# EAGLE schematic TEG-TEC Thermal Sensing and Regulating Board (EAGLE 9.5.1)

## Sheet 1 of 2
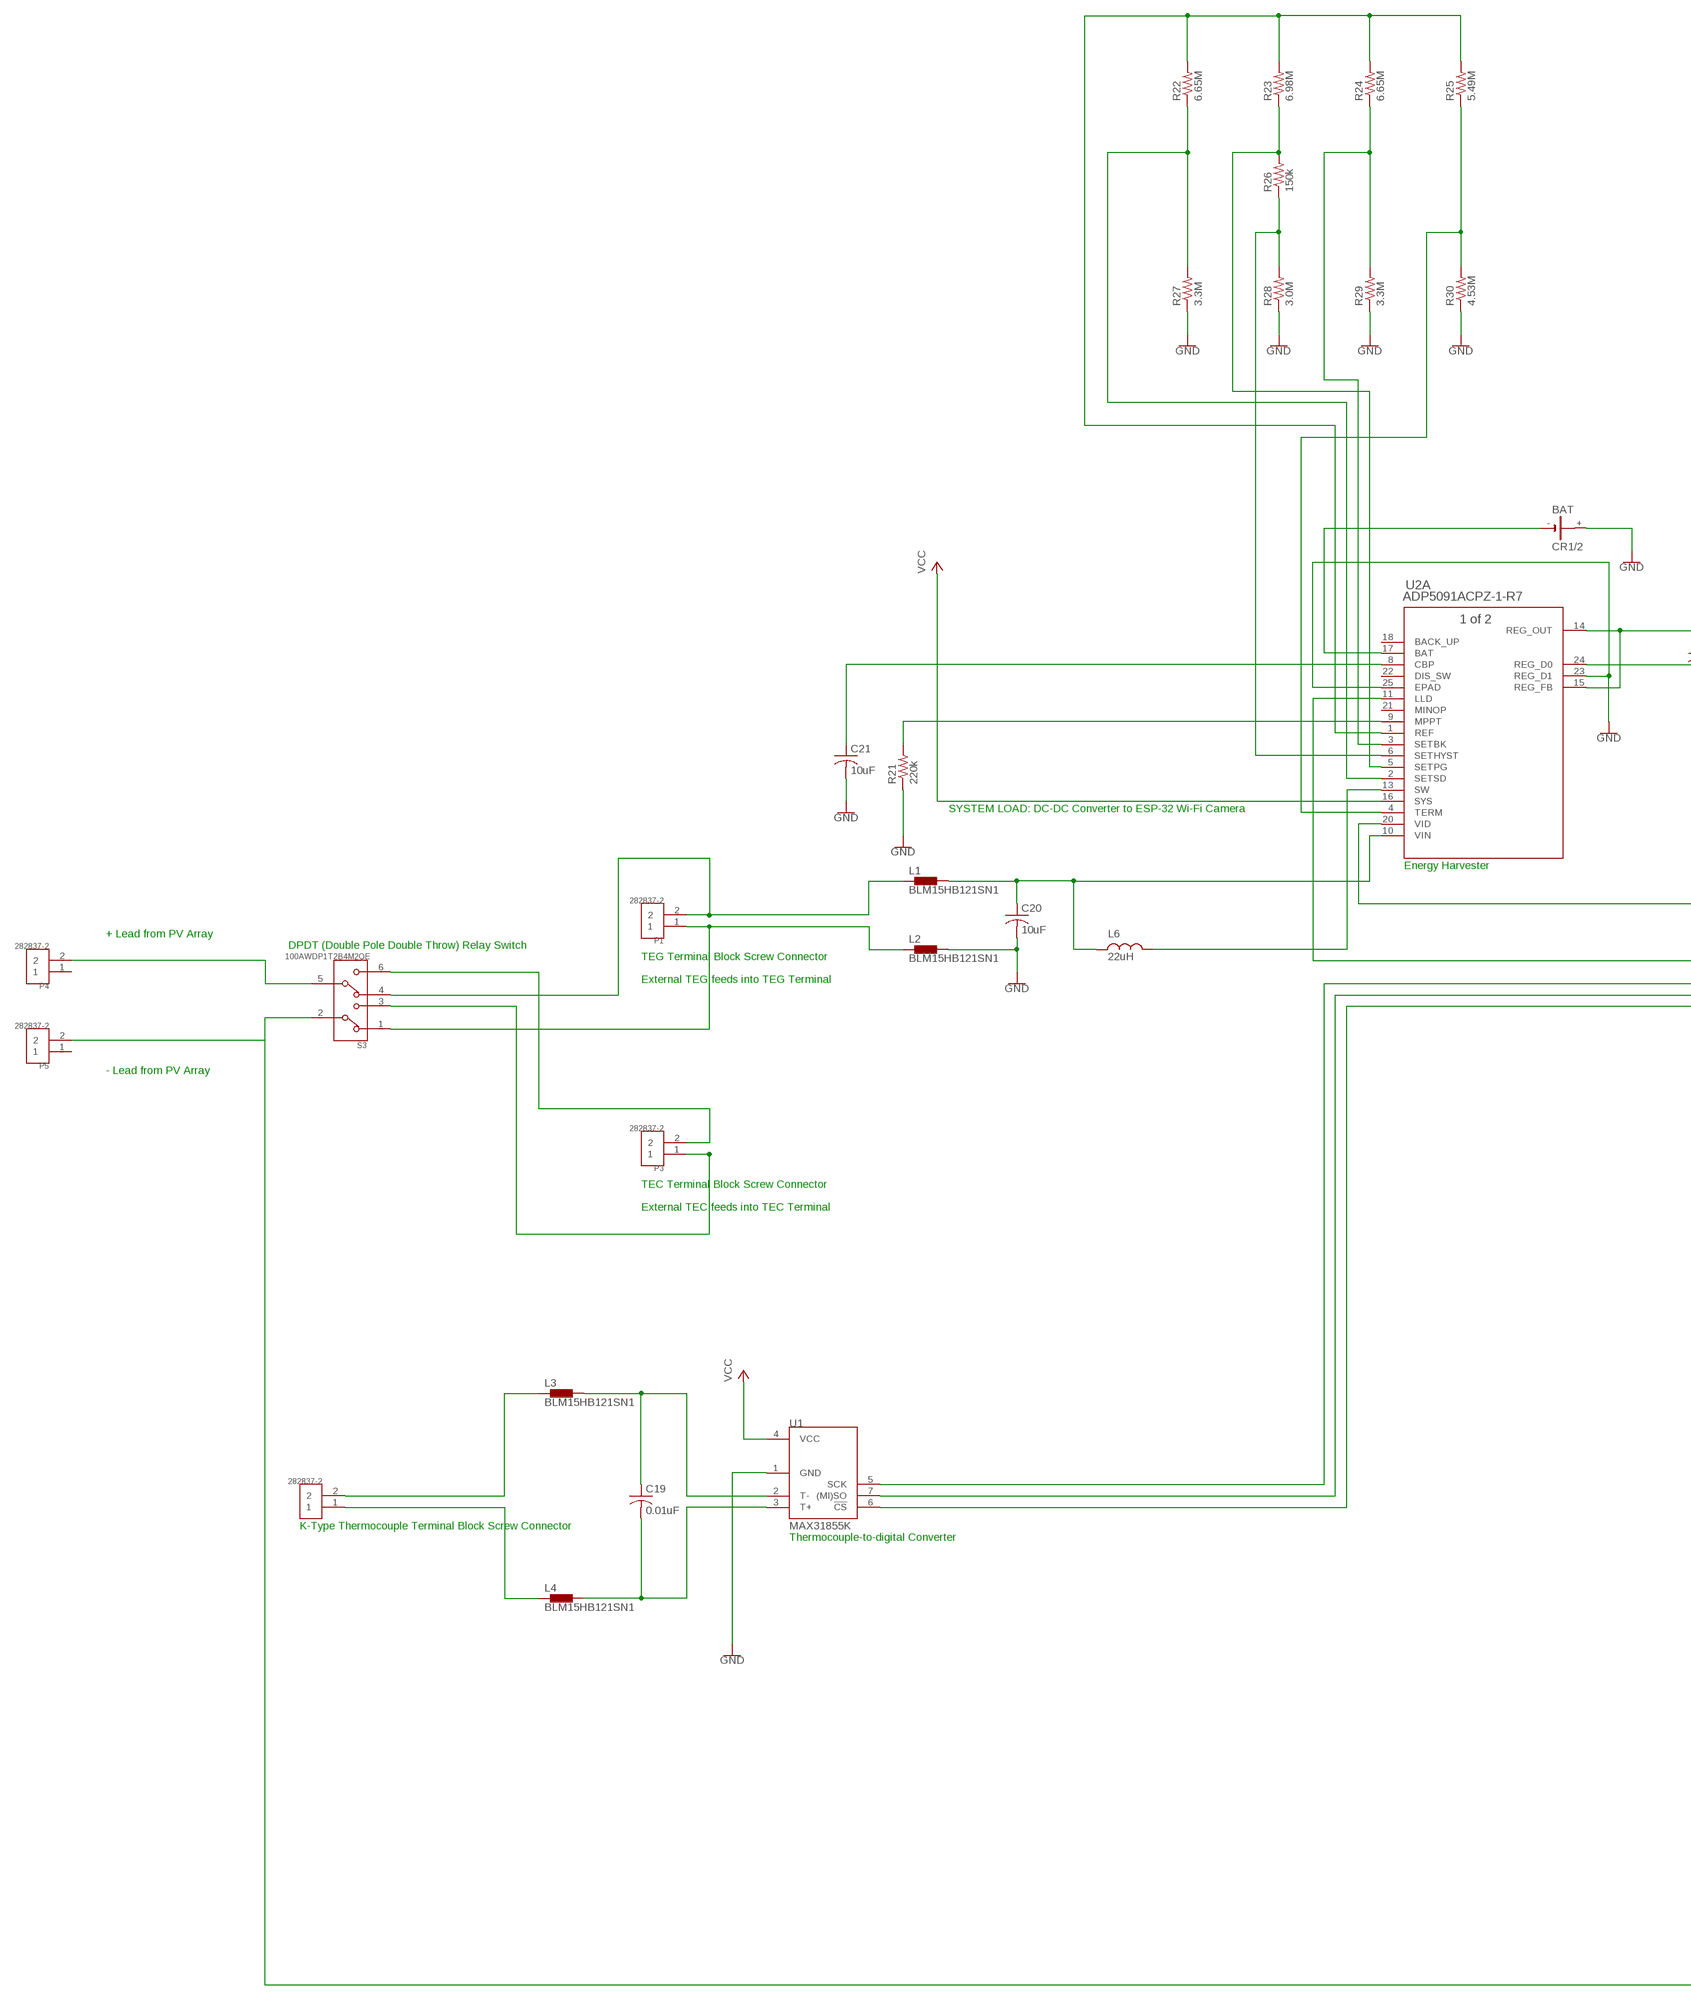
[diagram p0: schematic, sheet 1, part 1 of 2]
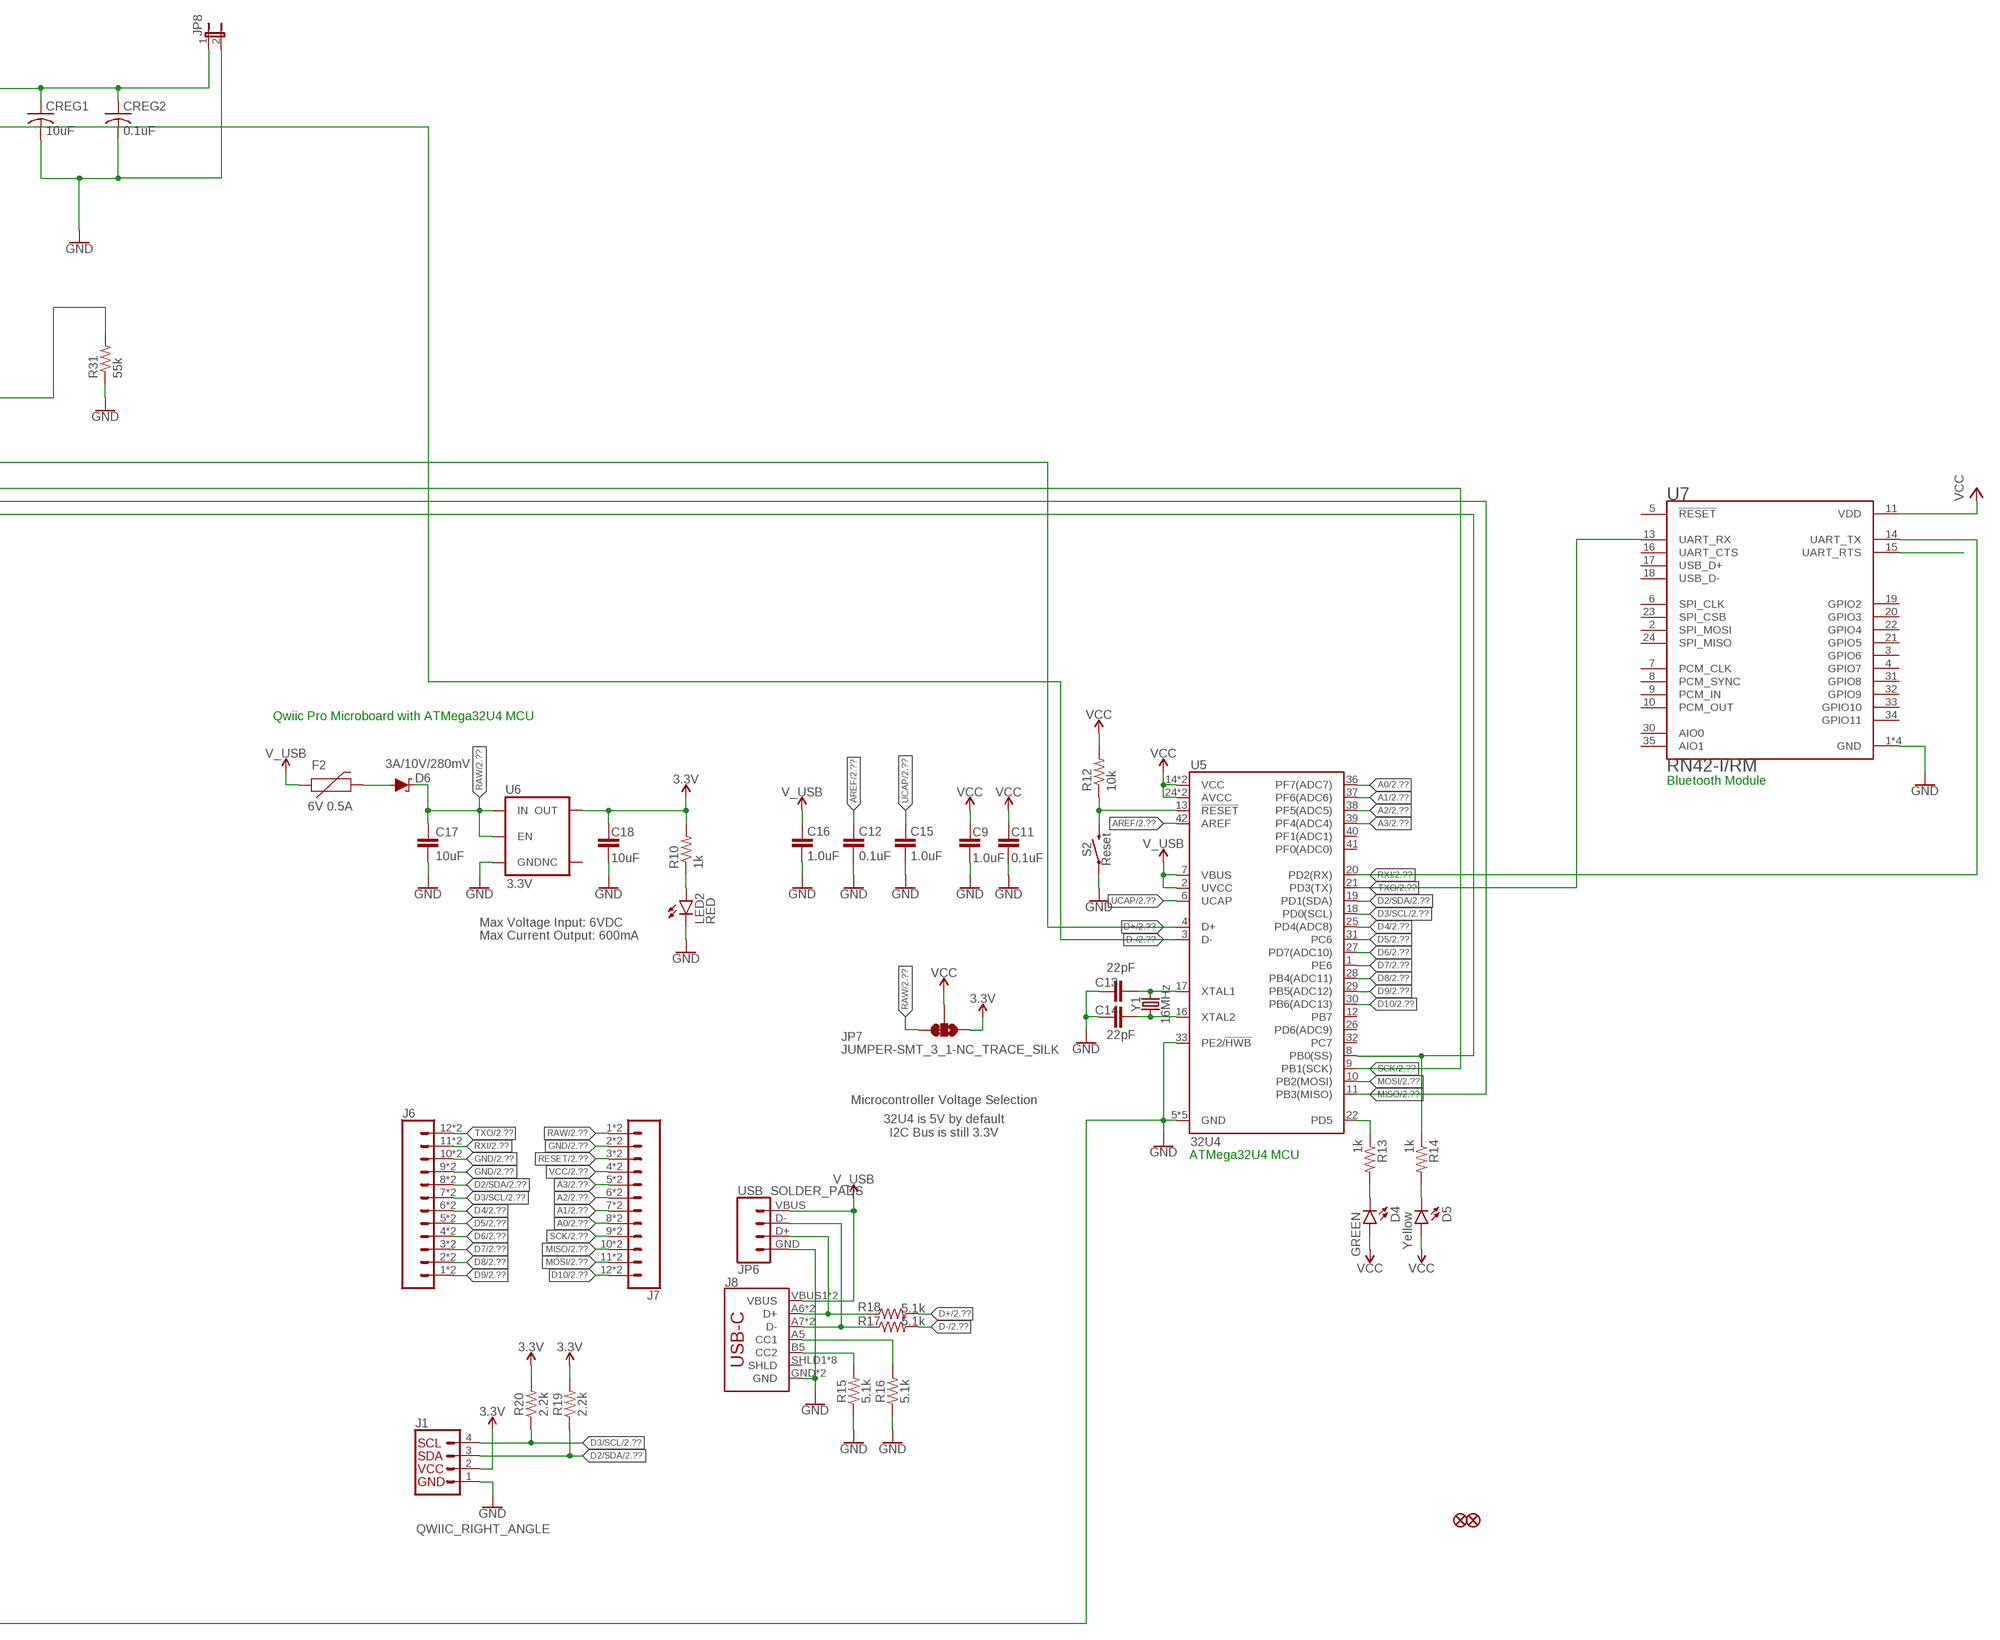
[diagram p1: schematic, sheet 1, part 2 of 2]

### Parts
BAT  CR1/2  [CR1/2]
C9  1.0uF  1.0UF-0402T-16V-10%  [0402-TIGHT]
C11  0.1uF  0.1UF-0402T-16V-10%  [0402-TIGHT]
C12  0.1uF  0.1UF-0402T-16V-10%  [0402-TIGHT]
C13  22pF  22PF-0402T-16V-10%  [0402-TIGHT]
C14  22pF  22PF-0402T-16V-10%  [0402-TIGHT]
C15  1.0uF  1.0UF-0402T-16V-10%  [0402-TIGHT]
C16  1.0uF  1.0UF-0402T-16V-10%  [0402-TIGHT]
C17  10uF  10UF-0603-6.3V-20%  [0603]
C18  10uF  10UF-0603-6.3V-20%  [0603]
C19  0.01uF  C-US025-024X044  [C025-024X044]
C20  10uF  C-US025-024X044  [C025-024X044]
C21  10uF  C-US025-024X044  [C025-024X044]
CREG1  10uF  C-US025-024X044  [C025-024X044]
CREG2  0.1uF  C-US025-024X044  [C025-024X044]
D4  GREEN  LED-GREEN0603  [LED-0603]
D5  Yellow  LED-YELLOW0603  [LED-0603]
D6  3A/10V/280mV  DIODE-SCHOTTKY-BAT60A  [SOD-323]
F2  6V 0.5A  PPTC_6V500MA  [0805]
J1  QWIIC_RIGHT_ANGLE  QWIIC_CONNECTORJS-1MM  [JST04_1MM_RA]
J6  CONN_12CASTLE  [1X12_CASTELLATED]
J7  CONN_12CASTLE  [1X12_CASTELLATED]
J8  USB_C5  [USB-C-16P-5]
JP3  FIDUCIAL1X2  [FIDUCIAL-1X2]
JP5  FIDUCIAL1X2  [FIDUCIAL-1X2]
JP6  USB_SOLDER_PADS  [USB-SOLDER-PADS]
JP7  JUMPER-SMT_3_1-NC_TRACE_SILK  [SMT-JUMPER_3_1-NC_TRACE_SILK]
JP8  JP1E  [JP1]
L1  BLM15HB121SN1  [0402]
L2  BLM15HB121SN1  [0402]
L3  BLM15HB121SN1  [0402]
L4  BLM15HB121SN1  [0402]
L6  22uH  L  (no package)
LED2  RED  LED-RED0603  [LED-0603]
P1  282837-2  [TE_282837-2]
P2  282837-2  [TE_282837-2]
P3  282837-2  [TE_282837-2]
P4  282837-2  [TE_282837-2]
P5  282837-2  [TE_282837-2]
R10  1k  1KOHM-0402T-1/16W-1%  [0402-TIGHT]
R12  10k  10KOHM-0402T-1/16W-1%  [0402-TIGHT]
R13  1k  1KOHM-0402T-1/16W-1%  [0402-TIGHT]
R14  1k  1KOHM-0402T-1/16W-1%  [0402-TIGHT]
R15  5.1k  5.1KOHM-0402T-1/16W-1%  [0402-TIGHT]
R16  5.1k  5.1KOHM-0402T-1/16W-1%  [0402-TIGHT]
R17  5.1k  5.1KOHM-0402T-1/16W-1%  [0402-TIGHT]
R18  5.1k  5.1KOHM-0402T-1/16W-1%  [0402-TIGHT]
R19  2.2k  2.2KOHM-0402T-1/16W-1%  [0402-TIGHT]
R20  2.2k  2.2KOHM-0402T-1/16W-1%  [0402-TIGHT]
R21  220k  R-US_0204/2V  [0204V]
R22  6.65M  R-US_0204/2V  [0204V]
R23  6.98M  R-US_0204/2V  [0204V]
R24  6.65M  R-US_0204/2V  [0204V]
R25  5.49M  R-US_0204/2V  [0204V]
R26  150k  R-US_0204/2V  [0204V]
R27  3.3M  R-US_0204/2V  [0204V]
R28  3.0M  R-US_0204/2V  [0204V]
R29  3.3M  R-US_0204/2V  [0204V]
R30  4.53M  R-US_0204/2V  [0204V]
R31  55k  R-US_0204/2V  [0204V]
S2  Reset  MOMENTARY-SWITCH-SPST-SMD-4.6X2.8MM  [TACTILE_SWITCH_SMD_4.6X2.8MM]
S3  100AWDP1T2B4M2QE  [SW_100AWDP1T2B4M2QE]
U1  MAX31855K  [SO08]
U2  ADP5091ACPZ-1-R7  [ADP5091ACPZ-1-R7_ADI]
U5  32U4  ATMEGA32U41:1-LESS_PASTE  [QFN-44-NOPAD_1:1-LESS_PASTE]
U6  3.3V  V_REG_AP2112K-3.3V  [SOT23-5]
U7  RN42-I/RM  [XCVR_RN42-I/RM]
Y1  16MHz  CRYSTAL-16MHZSMD-2X1.6  [CRYSTAL-SMD-2.0X1.6MM]

### Nets
3.3V: C18.2 J1.2 JP7.1 R10.2 R19.2 R20.2 U6.5(OUT) ; also sheet 2
A0: J7.8 J7.8B U5.36(PF7(ADC7)) ; also sheet 2
A1: J7.7 J7.7B U5.37(PF6(ADC6)) ; also sheet 2
A2: J7.6 J7.6B U5.38(PF5(ADC5)) ; also sheet 2
A3: J7.5 J7.5B U5.39(PF4(ADC4)) ; also sheet 2
AREF: C12.2 U5.42(AREF) ; also sheet 2
D2/SDA: J1.3 J6.8 J6.8B R19.1 U5.19(PD1(SDA)) ; also sheet 2
D3/SCL: J1.4 J6.7 J6.7B R20.1 U5.18(PD0(SCL)) ; also sheet 2
D4: J6.6 J6.6B U5.25(PD4(ADC8)) ; also sheet 2
D5: J6.5 J6.5B U5.31(PC6) ; also sheet 2
D6: J6.4 J6.4B U5.27(PD7(ADC10)) ; also sheet 2
D7: J6.3 J6.3B U5.1(PE6) ; also sheet 2
D8: J6.2 J6.2B U5.28(PB4(ADC11)) ; also sheet 2
D9: J6.1 J6.1B U5.29(PB5(ADC12)) ; also sheet 2
D10: J7.12 J7.12B U5.30(PB6(ADC13)) ; also sheet 2
D+: R18.2 U2.11(A:LLD) U5.4(D+) ; also sheet 2
D-: R17.2 U2.24(A:REG_D0) U5.3(D-) ; also sheet 2
D-_HV1: J8.A7(D-) J8.B7(D-) JP6.D- R17.1
DP_HV1: J8.A6(D+) J8.B6(D+) JP6.D+ R18.1
GND: BAT.+ C9.1 C11.1 C12.1 C13.2 C14.2 C15.1 C16.1 C17.1 C18.1 C20.2 C21.2 CREG1.2 CREG2.2 J1.1 J6.9 J6.9B J6.10 J6.10B J7.2 J7.2B J8.GND J8.GND2(GND) JP6.GND JP8.2 L2.2 LED2.C P5.2 R15.1 R16.1 R21.1 R27.1 R28.1 R29.1 R30.1 R31.1 S2.1 S2.2 S3.2 U1.1(GND) U5.5(GND) U5.15(GND) U5.23(GND) U5.33(PE2/!HWB) U5.35(GND) U5.43(GND) U6.2(GND) U7.1(GND) U7.12(GND) U7.28(GND) U7.29(GND) ; also sheet 2
MISO: J7.10 J7.10B U1.7((MI)SO) U5.11(PB3(MISO)) ; also sheet 2
MOSI: J7.11 J7.11B U5.10(PB2(MOSI)) ; also sheet 2
N$3: LED2.A R10.1
N$4: C14.1 U5.16(XTAL2) Y1.1
N$6: C13.1 U5.17(XTAL1) Y1.3
N$8: D5.C R14.2
N$11: D4.C R13.2
N$12: J8.A5(CC1) R16.2
N$13: J8.B5(CC2) R15.2
N$14: P3.2 S3.6
N$15: L1.1 P1.2 S3.4
N$16: L2.1 P1.1 S3.1
N$17: P3.1 S3.3
N$18: L3.1 P2.2
N$19: U7.15(UART_RTS)
N$20: L4.1 P2.1
N$21: C19.1 L3.2 U1.2(T-)
N$22: C19.2 L4.2 U1.3(T+)
N$23: C20.1 L1.2 L6.1 U2.10(A:VIN)
N$24: R21.2 U2.9(A:MPPT)
N$25: C21.1 U2.8(A:CBP)
N$26: L6.2 U2.13(A:SW)
N$27: R22.2 R23.2 R24.2 R25.2 U2.1(A:REF)
N$28: R22.1 R27.2 U2.2(A:SETSD)
N$29: R23.1 R26.2 U2.5(A:SETPG)
N$30: R26.1 R28.2 U2.6(A:SETHYST)
N$31: R24.1 R29.2 U2.3(A:SETBK)
N$32: R25.1 R30.2 U2.4(A:TERM)
N$33: CREG1.1 CREG2.1 JP8.1 U2.14(A:REG_OUT) U2.15(A:REG_FB)
N$34: BAT.- U2.17(A:BAT)
N$35: R31.2 U2.20(A:VID)
N$36: U2.23(A:REG_D1) U2.25(A:EPAD) ; supply symbol labelled GND
N$37: P4.2 S3.5
RAW [vcc]: C17.2 D6.C J7.1 J7.1B JP7.3 U6.1(IN) U6.3(EN) ; also sheet 2
RESET: J7.3 J7.3B R12.1 S2.3 S2.4 U5.13(!RESET) ; also sheet 2
RXI: J6.11 J6.11B U5.20(PD2(RX)) U7.14(UART_TX) ; also sheet 2
RXLED1: R14.1 U1.6(!CS) U5.8(PB0(SS))
SCK: J7.9 J7.9B U1.5(SCK) U5.9(PB1(SCK)) ; also sheet 2
TXLED1: R13.1 U5.22(PD5)
TXO: J6.12 J6.12B U5.21(PD3(TX)) U7.13(UART_RX) ; also sheet 2
UCAP: C15.2 U5.6(UCAP) ; also sheet 2
USB_RAW1: D6.A F2.2
V_USB: C16.2 F2.1 J8.VBUS1(VBUS) J8.VBUS2(VBUS) JP6.VBUS U5.2(UVCC) U5.7(VBUS) ; also sheet 2
VCC: C9.2 C11.2 D4.A D5.A J7.4 J7.4B JP7.2 R12.2 U1.4(VCC) U2.16(A:SYS) U5.14(VCC) U5.24(AVCC) U5.34(VCC) U5.44(AVCC) U7.11(VDD) ; also sheet 2
Unconnected: BAT.+@1(+) J8.SHLD1(SHLD) J8.SHLD2(SHLD) J8.SHLD3(SHLD) J8.SHLD4(SHLD) J8.SHLD5(SHLD) J8.SHLD6(SHLD) J8.SHLD7(SHLD) J8.SHLD8(SHLD) P4.1 P5.1 U2.7(B:AGND) U2.12(B:PGND) U2.18(A:BACK_UP) U2.19(B:PGOOD) U2.21(A:MINOP) U2.22(A:DIS_SW) U5.12(PB7) U5.26(PD6(ADC9)) U5.32(PC7) U5.40(PF1(ADC1)) U5.41(PF0(ADC0)) U6.4(NC) U7.2(SPI_MOSI) U7.3(GPIO6) U7.4(GPIO7) U7.5(!RESET) U7.6(SPI_CLK) U7.7(PCM_CLK) U7.8(PCM_SYNC) U7.9(PCM_IN) U7.10(PCM_OUT) U7.16(UART_CTS) U7.17(USB_D+) U7.18(USB_D-) U7.19(GPIO2) U7.20(GPIO3) U7.21(GPIO5) U7.22(GPIO4) U7.23(SPI_CSB) U7.24(SPI_MISO) U7.30(AIO0) U7.31(GPIO8) U7.32(GPIO9) U7.33(GPIO10) U7.34(GPIO11) U7.35(AIO1)

### Notes on the sheet
- SYSTEM LOAD: DC-DC Converter to ESP-32 Wi-Fi Camera
- Energy Harvester
- + Lead from PV Array
- DPDT (Double Pole Double Throw) Relay Switch
- TEG Terminal Block Screw Connector
- External TEG feeds into TEG Terminal
- - Lead from PV Array
- TEC Terminal Block Screw Connector | Qwiic Pro Microboard with ATMega32U4 MCU
- External TEC feeds into TEC Terminal
- Bluetooth Module
- Max Voltage Input: 6VDC
- Max Current Output: 600mA
- Microcontroller Voltage Selection
- K-Type Thermocouple Terminal Block Screw Connector
- Thermocouple-to-digital Converter
- 32U4 is 5V by default
  I2C Bus is still 3.3V
- ATMega32U4 MCU

## Sheet 2 of 2
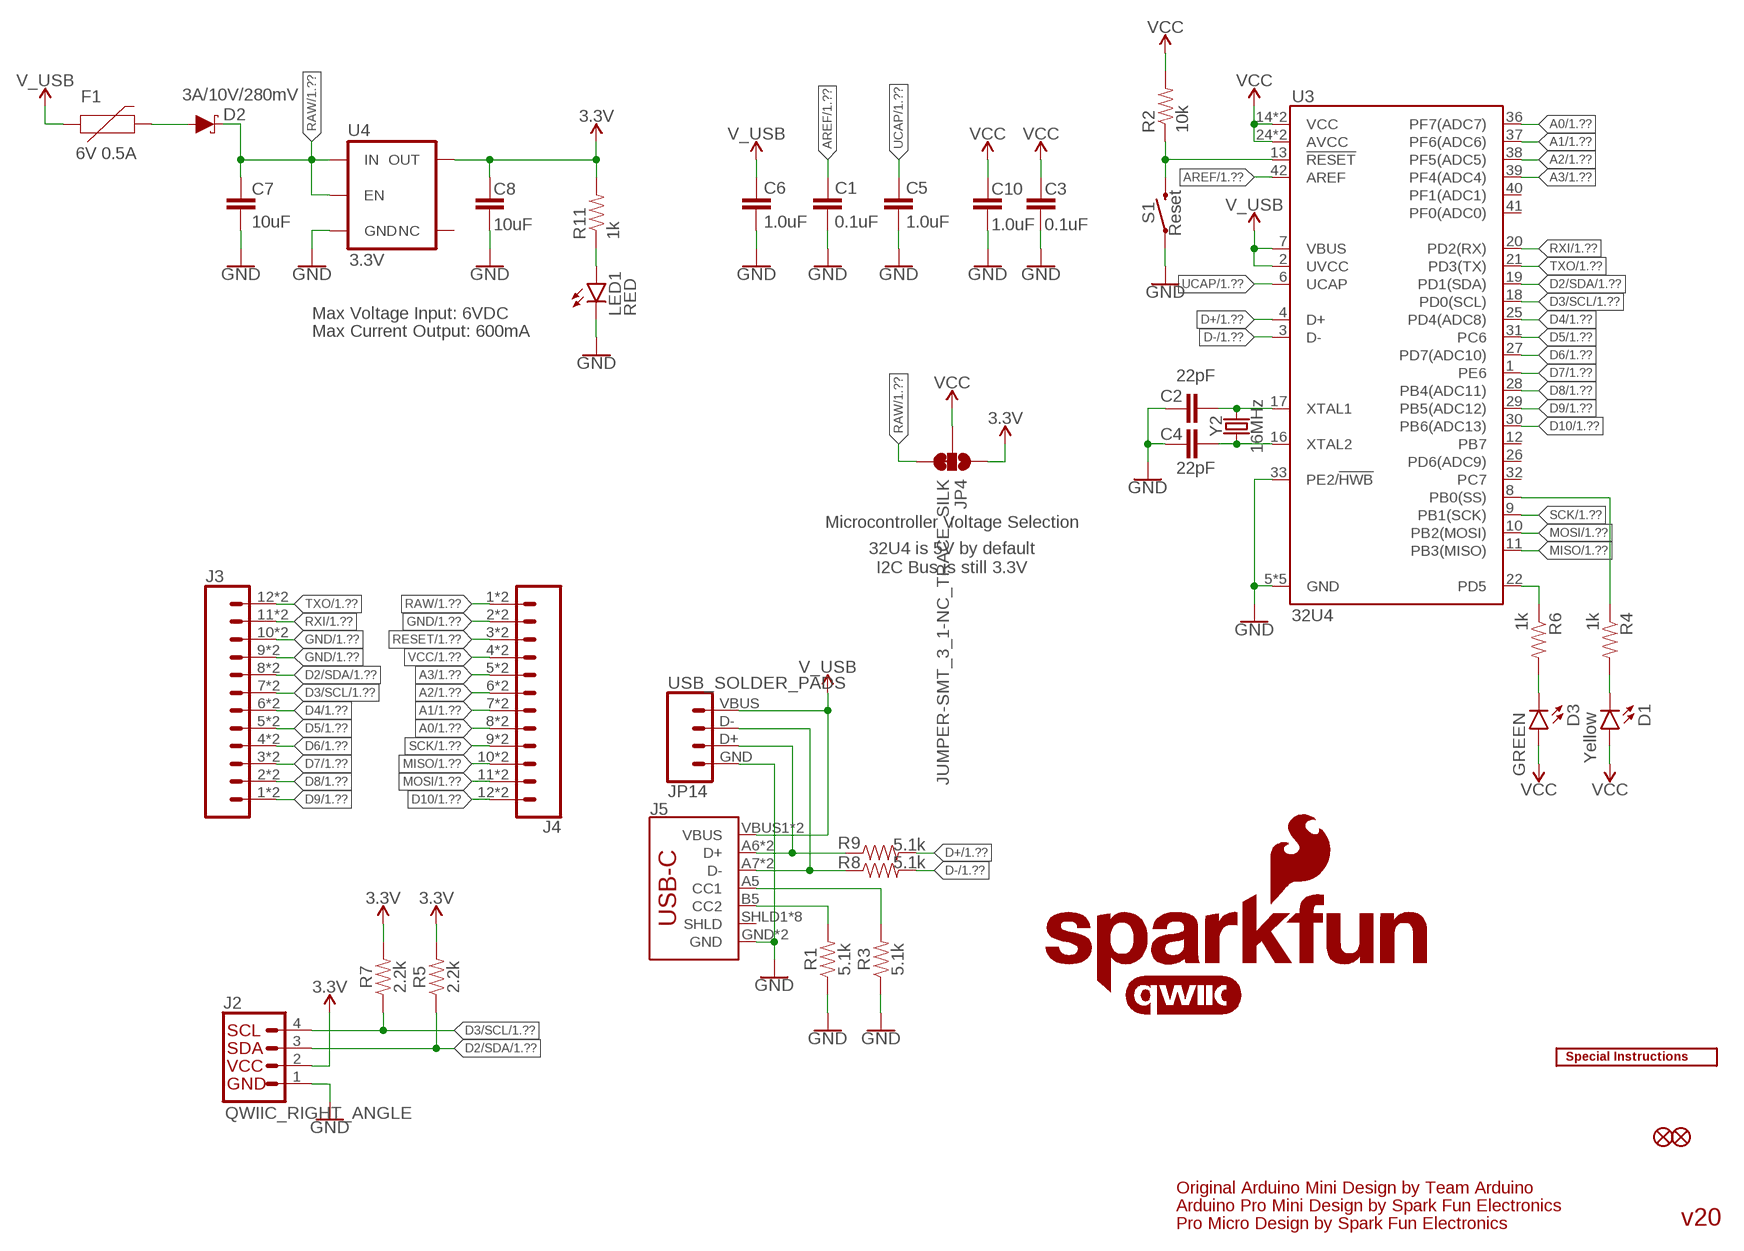
[diagram p2: schematic, sheet 2]

### Parts
C1  0.1uF  0.1UF-0402T-16V-10%  [0402-TIGHT]
C2  22pF  22PF-0402T-16V-10%  [0402-TIGHT]
C3  0.1uF  0.1UF-0402T-16V-10%  [0402-TIGHT]
C4  22pF  22PF-0402T-16V-10%  [0402-TIGHT]
C5  1.0uF  1.0UF-0402T-16V-10%  [0402-TIGHT]
C6  1.0uF  1.0UF-0402T-16V-10%  [0402-TIGHT]
C7  10uF  10UF-0603-6.3V-20%  [0603]
C8  10uF  10UF-0603-6.3V-20%  [0603]
C10  1.0uF  1.0UF-0402T-16V-10%  [0402-TIGHT]
D1  Yellow  LED-YELLOW0603  [LED-0603]
D2  3A/10V/280mV  DIODE-SCHOTTKY-BAT60A  [SOD-323]
D3  GREEN  LED-GREEN0603  [LED-0603]
F1  6V 0.5A  PPTC_6V500MA  [0805]
J2  QWIIC_RIGHT_ANGLE  QWIIC_CONNECTORJS-1MM  [JST04_1MM_RA]
J3  CONN_12CASTLE  [1X12_CASTELLATED]
J4  CONN_12CASTLE  [1X12_CASTELLATED]
J5  USB_C5  [USB-C-16P-5]
JP1  FIDUCIAL1X2  [FIDUCIAL-1X2]
JP2  FIDUCIAL1X2  [FIDUCIAL-1X2]
JP4  JUMPER-SMT_3_1-NC_TRACE_SILK  [SMT-JUMPER_3_1-NC_TRACE_SILK]
JP14  USB_SOLDER_PADS  [USB-SOLDER-PADS]
LED1  RED  LED-RED0603  [LED-0603]
LOGO1  SFE_LOGO_NAME_FLAME.1_INCH  [SFE_LOGO_NAME_FLAME_.1]
LOGO2  QWIIC_LOGO_4MM  [QWIIC_4MM]
LOGO3  QWIIC_LOGO_6MM  [QWIIC_6MM]
LOGO4  SFE_LOGO_FLAME.1_INCH  [SFE_LOGO_FLAME_.1]
LOGO5  SPECIAL_INSTRUCTIONS-ORDERING  [ORDERING_INSTRUCTIONS]
R1  5.1k  5.1KOHM-0402T-1/16W-1%  [0402-TIGHT]
R2  10k  10KOHM-0402T-1/16W-1%  [0402-TIGHT]
R3  5.1k  5.1KOHM-0402T-1/16W-1%  [0402-TIGHT]
R4  1k  1KOHM-0402T-1/16W-1%  [0402-TIGHT]
R5  2.2k  2.2KOHM-0402T-1/16W-1%  [0402-TIGHT]
R6  1k  1KOHM-0402T-1/16W-1%  [0402-TIGHT]
R7  2.2k  2.2KOHM-0402T-1/16W-1%  [0402-TIGHT]
R8  5.1k  5.1KOHM-0402T-1/16W-1%  [0402-TIGHT]
R9  5.1k  5.1KOHM-0402T-1/16W-1%  [0402-TIGHT]
R11  1k  1KOHM-0402T-1/16W-1%  [0402-TIGHT]
S1  Reset  MOMENTARY-SWITCH-SPST-SMD-4.6X2.8MM  [TACTILE_SWITCH_SMD_4.6X2.8MM]
U3  32U4  ATMEGA32U41:1-LESS_PASTE  [QFN-44-NOPAD_1:1-LESS_PASTE]
U4  3.3V  V_REG_AP2112K-3.3V  [SOT23-5]
Y2  16MHz  CRYSTAL-16MHZSMD-2X1.6  [CRYSTAL-SMD-2.0X1.6MM]

### Nets
3.3V: C8.2 J2.2 JP4.1 R5.2 R7.2 R11.2 U4.5(OUT) ; also sheet 1
A0: J4.8 J4.8B U3.36(PF7(ADC7)) ; also sheet 1
A1: J4.7 J4.7B U3.37(PF6(ADC6)) ; also sheet 1
A2: J4.6 J4.6B U3.38(PF5(ADC5)) ; also sheet 1
A3: J4.5 J4.5B U3.39(PF4(ADC4)) ; also sheet 1
AREF: C1.2 U3.42(AREF) ; also sheet 1
D2/SDA: J2.3 J3.8 J3.8B R5.1 U3.19(PD1(SDA)) ; also sheet 1
D3/SCL: J2.4 J3.7 J3.7B R7.1 U3.18(PD0(SCL)) ; also sheet 1
D4: J3.6 J3.6B U3.25(PD4(ADC8)) ; also sheet 1
D5: J3.5 J3.5B U3.31(PC6) ; also sheet 1
D6: J3.4 J3.4B U3.27(PD7(ADC10)) ; also sheet 1
D7: J3.3 J3.3B U3.1(PE6) ; also sheet 1
D8: J3.2 J3.2B U3.28(PB4(ADC11)) ; also sheet 1
D9: J3.1 J3.1B U3.29(PB5(ADC12)) ; also sheet 1
D10: J4.12 J4.12B U3.30(PB6(ADC13)) ; also sheet 1
D+: R9.2 U3.4(D+) ; also sheet 1
D-: R8.2 U3.3(D-) ; also sheet 1
D-_HV: J5.A7(D-) J5.B7(D-) JP14.D- R8.1
DP_HV: J5.A6(D+) J5.B6(D+) JP14.D+ R9.1
GND: C1.1 C2.2 C3.1 C4.2 C5.1 C6.1 C7.1 C8.1 C10.1 J2.1 J3.9 J3.9B J3.10 J3.10B J4.2 J4.2B J5.GND J5.GND2(GND) JP14.GND LED1.C R1.1 R3.1 S1.1 S1.2 U3.5(GND) U3.15(GND) U3.23(GND) U3.33(PE2/!HWB) U3.35(GND) U3.43(GND) U4.2(GND) ; also sheet 1
MISO: J4.10 J4.10B U3.11(PB3(MISO)) ; also sheet 1
MOSI: J4.11 J4.11B U3.10(PB2(MOSI)) ; also sheet 1
N$1: C4.1 U3.16(XTAL2) Y2.1
N$2: C2.1 U3.17(XTAL1) Y2.3
N$5: D1.C R4.2
N$7: D3.C R6.2
N$9: J5.A5(CC1) R3.2
N$10: J5.B5(CC2) R1.2
N$38: LED1.A R11.1
RAW [vcc]: C7.2 D2.C J4.1 J4.1B JP4.3 U4.1(IN) U4.3(EN) ; also sheet 1
RESET: J4.3 J4.3B R2.1 S1.3 S1.4 U3.13(!RESET) ; also sheet 1
RXI: J3.11 J3.11B U3.20(PD2(RX)) ; also sheet 1
RXLED: R4.1 U3.8(PB0(SS))
SCK: J4.9 J4.9B U3.9(PB1(SCK)) ; also sheet 1
TXLED: R6.1 U3.22(PD5)
TXO: J3.12 J3.12B U3.21(PD3(TX)) ; also sheet 1
UCAP: C5.2 U3.6(UCAP) ; also sheet 1
USB_RAW: D2.A F1.2
V_USB: C6.2 F1.1 J5.VBUS1(VBUS) J5.VBUS2(VBUS) JP14.VBUS U3.2(UVCC) U3.7(VBUS) ; also sheet 1
VCC: C3.2 C10.2 D1.A D3.A J4.4 J4.4B JP4.2 R2.2 U3.14(VCC) U3.24(AVCC) U3.34(VCC) U3.44(AVCC) ; also sheet 1
Unconnected: J5.SHLD1(SHLD) J5.SHLD2(SHLD) J5.SHLD3(SHLD) J5.SHLD4(SHLD) J5.SHLD5(SHLD) J5.SHLD6(SHLD) J5.SHLD7(SHLD) J5.SHLD8(SHLD) U3.12(PB7) U3.26(PD6(ADC9)) U3.32(PC7) U3.40(PF1(ADC1)) U3.41(PF0(ADC0)) U4.4(NC)

### Notes on the sheet
- Max Voltage Input: 6VDC
- Max Current Output: 600mA
- Microcontroller Voltage Selection
- 32U4 is 5V by default
  I2C Bus is still 3.3V
- Original Arduino Mini Design by Team Arduino
- Arduino Pro Mini Design by Spark Fun Electronics
- Pro Micro Design by Spark Fun Electronics | v20

## Library data of the parts
BAT = battery:CR1/2: LI BATTERY Sonnenschein SL-350 PT
C1 C3 C11 C12 = SparkFun-Capacitors:0.1UF: 0.1µF ceramic capacitors A capacitor is a passive two-terminal electrical component used to store electrical energy temporarily in an electric field.; PROD_ID: CAP-12416
C2 C4 C13 C14 = SparkFun-Capacitors:22PF: 22pF ceramic capacitors A capacitor is a passive two-terminal electrical component used to store electrical energy temporarily in an electric field.; PROD_ID: CAP-14674
C5 C6 C9 C10 C15 C16 = SparkFun-Capacitors:1.0UF: 1µF ceramic capacitors A capacitor is a passive two-terminal electrical component used to store electrical energy temporarily in an electric field.; PROD_ID: CAP-12417
C7 C8 C17 C18 = SparkFun-Capacitors:10UF: 10.0µF ceramic capacitors A capacitor is a passive two-terminal electrical component used to store electrical energy temporarily in an electric field.; PROD_ID: CAP-11015
C19-C21 CREG1 CREG2 = rcl:C-US: CAPACITOR, American symbol; SPICEPREFIX: C
D1 D5 = SparkFun-LED:LED-YELLOW: Yellow SMD LED Used in manufacturing several products at SparkFun. Packages: 0603 - SMD 0603 package[Product Link] <http://www.kingbrightusa.com/product.asp?catalog_name=LED&product_id=APT1608SYCK> 0603 -SMART - SMART SMD 0603 package (more efficient/more expensive) [Product Link] <http://www.osram-os.com/osram_os/en/products/product-catalog/led-light-emitting-diodes/smartled-0603/ly-l29k/index.jsp> LilyPad - SMD1206 package[Product Datasheet] <https://www.sparkfun.com/datasheets/DevTools/LilyPad/Q150YUS4.pdf> SparkFun Products: Blynk Board <https://www.sparkfun.com/products/13794> IOIO-OTG <https://www.sparkfun.com/products/13613> XBee Explorer Serial <https://www.sparkfun.com/products/13225>; PROD_ID: DIO-09003
D2 D6 = SparkFun-DiscreteSemi:DIODE-SCHOTTKY: Schottky diode A Schottky diode is a semiconductor diode which has a low forward voltage drop and a very fast switching action.; PROD_ID: DIO-14072
D3 D4 = SparkFun-LED:LED-GREEN: Green SMD LED Used in manufacturing of various products at SparkFun Packages: 0603 - SMD 0603 package [Product Link] <http://www.futureelectronics.com/en/technologies/semiconductors/optoelectronics/leds/Pages/9894312-LTST-C190GKT.aspx?CrossPart=HSMG-C190&IM=0> LilyPad 1206 - SMD1206 LilyPad package [Product Link] <http://www.futureelectronics.com/en/Technologies/Product.aspx?ProductID=IN150NGHARVATEKCORPORATION2049943&IM=0> 1206 - SMD1206 package [Product Link] <http://www.futureelectronics.com/en/technologies/semiconductors/optoelectronics/leds/Pages/8315665-LTST-C150KGKT.aspx?IM=0> 1206 Bottom Mount -SMD 1206 Bottom Mount [Product Link] <http://www.digikey.com/product-detail/en/lite-on-inc/LTST-C230KGKT/160-1456-1-ND/386854> SparkFun Products: Pro Mini 328 -5V <https://www.sparkfun.com/products/821> RedBoard <https://www.sparkfun.com/products/12757> MP3 Trigger <https://www.sparkfun.com/products/13720> Makey Makey <https://www.sparkfun.com/products/11076>; PROD_ID: DIO-00821
F1 F2 = SparkFun-Fuses:PPTC: Resettable Fuse PPTC Resettable Fuse. Really a sort of resistor with a polymeric positive temperature coefficient whose resistance increases dramatically with an increase in temperature. When heated by the power passing through the resistance rises causing the current to be limited, protecting the circuit. This is achieved by the transition of the polymer from a crystalline to an amorphous state where the conductive carbon separates breaking the conductive pathways found in the cool crystalline structure. When a PPTC cools back down it resumes conducting letting the circuit turn back on. SparkFun Products: SparkFun RedBoard - Programmed with Arduino <https://www.sparkfun.com/products/12757> Pro Micro - 5V/16MHz <https://www.sparkfun.com/products/12640> Arduino Pro 328 - 5V/16MHz <https://www.sparkfun.com/products/10915> MP3 Trigger <https://www.sparkfun.com/products/13720>; PROD_ID: RES-13945
J1 J2 = SparkFun-Connectors:QWIIC_CONNECTOR: SparkFun I2C Standard Qwiic Connector An SMD 1mm pitch JST connector makes it easy and quick (get it? Qwiic?) to connect I2C devices to each other. The Qwiic system <http://www.sparkfun.com/qwiic> enables fast and solderless connection between popular platforms and various sensors and actuators. We carry 200mm <https://www.sparkfun.com/products/14204>, 100mm <https://www.sparkfun.com/products/14205>, 50mm <https://www.sparkfun.com/products/14206>, and breadboard friendly <https://www.sparkfun.com/products/14207> Qwiic cables. We also offer 10 pcs strips <https://www.sparkfun.com/products/14323> the SMD connectors.; PROD_ID: CONN-13694
J3 J4 J6 J7 = Castellated:CONN_12: Multi connection point. Often used as Generic Header-pin footprint for 0.1 inch spaced/style header connections On any of the 0.1 inch spaced packages, you can populate with these: Break Away Headers - Straight <https://www.sparkfun.com/products/116> (PRT-00116) Break Away Male Headers - Right Angle <https://www.sparkfun.com/products/553> (PRT-00553) Female Headers <https://www.sparkfun.com/products/115> (PRT-00115) Break Away Headers - Machine Pin <https://www.sparkfun.com/products/117> (PRT-00117) Break Away Female Headers - Swiss Machine Pin <https://www.sparkfun.com/products/743> (PRT-00743) For SCREWTERMINALS and SPRING TERMINALS visit here: Screw Terimnals on SparkFun.com <https://www.sparkfun.com/search/results?term=Screw+Terminals> (5mm/3.5mm/2.54mm spacing) This device is also useful as a general connection point to wire up your design to another part of your project. Our various solder wires solder well into these plated through hole pads. Hook-Up Wire - Assortment (Stranded, 22 AWG) <https://www.sparkfun.com/products/11375> (PRT-11375) Hook-Up Wire - Assortment (Solid Core, 22 AWG) <https://www.sparkfun.com/products/11367> (PRT-11367) View the entire wire category on our website here <https://www.sparkfun.com/categories/141> Special notes: Molex polarized connector foot print use with SKU : PRT-08231 with associated crimp pins and housings. 1MM SMD Version SKU: PRT-10208 NOTES ON THE VARIANTS LOCK and LOCK_LONGPADS... This footprint was designed to help hold the alignment of a through-hole component (i.e. 6-pin header) while soldering it into place. You may notice that each hole has been shifted either up or down by 0.005 of an inch from it's more standard position (which is a perfectly straight line). This slight alteration caused the pins (the squares in the middle) to touch the edges of the holes. Because they are alternating, it causes a "brace" to hold the component in place. 0.005 has proven to be the perfect amount of "off-center" position when using our standard breakaway headers. Although looks a little odd when you look at the bare footprint, once you have a header in there, the alteration is very hard to notice. Also,if you push a header all the way into place, it is covered up entirely on the bottom side.
J5 J8 = USBC:USB_C: USB Type C 16Pin Connector Super Speed pins not available on the 16-pin purely SMD connector so this part is best for USB 2.0 implementations. D1 and D2 are tied together enabling D+/- no matter which way the cable is plugged into the connector. The two channel configuration pins (CC1/2) are exposed. These are normally connected to ground via 5.1k resistors but can be reconfigured for high current/high power applications.
JP1-JP3 JP5 = SparkFun-Aesthetics:FIDUCIAL: Fiducial Alignment Points Point-of-reference for pick-and-place machines and other optical instruments.
JP4 JP7 = SparkFun-Jumpers:JUMPER-SMT_3_1-NC_TRACE: Normally closed trace jumper (1 of 2 connections) This jumper has a trace between two pads so it's normally closed (NC). The other connection is normally open (NO). Use a razor knife to open the connection. For best results follow the IPC guidelines for cutting traces: Cutout at least 0.063 mm (0.005 in). Remove all loose material to clean up the cut area. Seal the cut with an approved epoxy. Reapply solder to reclose the connection, or to close the NO connection.
JP6 JP14 = SparkFun-Connectors:USB_SOLDER_PADS: Solder pad access to USB pins. Helpful to expose on PCBs so user can attach external USB connector if necessary.
JP8 = jumper:JP1E: JUMPER
L1-L4 = inductors:BLM15H: EMIFIL (R) Chip Ferrite Bead for GHz Noise Source: http://www.murata.com/ Ferrite Bead BLM15H.pdf
L6 = ngspice-simulation:L: INDUCTOR
LED1 LED2 = SparkFun-LED:LED-RED: Red SMD LED Used in manufacturing of most products at SparkFun Packages: 0603 - SMD 0603 package [Product Link] <http://docs.avagotech.com/docs/AV02-0551EN> 0603 SMART - SMD 0603 SMART package ( more efficient and expensive)[Product Link] <http://www.osram-os.com/Graphics/XPic2/00077099_0.pdf> 1206 - SMD1206 package [Product Link] <https://www.sparkfun.com/datasheets/DevTools/LilyPad/Q150OVS4.pdff> SparkFun Products: Pro Mini 328 -5V <https://www.sparkfun.com/products/821> RedBoard <https://www.sparkfun.com/products/12757> IOIO-OTG <https://www.sparkfun.com/products/13613>; PROD_ID: DIO-00819
LOGO1 = SparkFun-Aesthetics:SFE_LOGO_NAME_FLAME: SparkFun Font Logo w/ Flame This is the SparkFun full logo. The logo on the schematic will always be the same size; the package variant is the height of the flame part of the logo. Default layer for the logo on the board is tSilk.
LOGO2 LOGO3 = SparkFun-Aesthetics:QWIIC_LOGO: Qwiic Logos for placement on schematic and PCB. The 5.5mm silk logo is best for placing next to Qwiic connector.
LOGO4 = SparkFun-Aesthetics:SFE_LOGO_FLAME: SparkFun Flame Logo This is the SparkFun flame logo. The logo on the schematic will always be the same size; the package variant is the height of the flame. Default layer for the logo on the board is tSilk.
LOGO5 = SparkFun-Aesthetics:SPECIAL_INSTRUCTIONS: Special Ordering/Production Instructions Alert Symbol for special PCB ordering instructions or unique production process warnings. Ordering Instructions Production Instructions Types of information that should be added to box: Copper weight Soldermask color Silk color PCB thickness Number of layers PCB Standard: 1.6mm FR4 1 oz copper immersion silver plating red soldermask white silkscreen Types of information that should be added to box: Special wash requirements Depaneling instructions Humidification Glue curing Default text settings: 0.07 inch 9% ratio 50% line distance
P1-P5 = 282837-2 Terminal Screw Connector Block:282837-2: TERM BLOCK 5.08MM 2POS SIDE ENTY Check availability <https://pricing.snapeda.com/parts/282837-2/TE%20Connectivity/view-part?ref=eda>; AVAILABILITY: In Stock; COMMENT: 282837-2; DESCRIPTION: Connector Terminal Blocks Receptacle 2 Position 5.08mm Solder Straight Thru-Hole 13.5A/Contact; EU_ROHS_COMPLIANCE: Compliant with Exemptions; MF: TE Connectivity; MP: 282837-2; PACKAGE: None; PRICE: None; PURCHASE-URL: https://pricing.snapeda.com/search/part/282837-2/?ref=eda
R1 R3 R8 R9 R15-R18 = SparkFun-Resistors:5.1KOHM; PROD_ID: RES-14340
R2 R12 = SparkFun-Resistors:10KOHM: 10kΩ resistor A resistor is a passive two-terminal electrical component that implements electrical resistance as a circuit element. Resistors act to reduce current flow, and, at the same time, act to lower voltage levels within circuits. - Wikipedia; PROD_ID: RES-14241
R4 R6 R10 R11 R13 R14 = SparkFun-Resistors:1KOHM: 1kΩ resistor A resistor is a passive two-terminal electrical component that implements electrical resistance as a circuit element. Resistors act to reduce current flow, and, at the same time, act to lower voltage levels within circuits. - Wikipedia; PROD_ID: RES-14342
R5 R7 R19 R20 = SparkFun-Resistors:2.2KOHM: 2.2kΩ resistor A resistor is a passive two-terminal electrical component that implements electrical resistance as a circuit element. Resistors act to reduce current flow, and, at the same time, act to lower voltage levels within circuits. - Wikipedia; PROD_ID: RES-14341
R21-R31 = rcl:R-US_: RESISTOR, American symbol; SPICEPREFIX: R
S1 S2 = SparkFun-Switches:MOMENTARY-SWITCH-SPST: Momentary Switch (Pushbutton) - SPST Normally-open (NO) SPST momentary switches (buttons, pushbuttons). Variants PTH-12MM - 12mm square, through-hole Momentary Pushbutton Switch - 12mm Square <https://www.sparkfun.com/products/9190> (COM-09190) PTH-6.0MM, PTH-6.0MM-KIT - 6.0mm square, through-hole Mini Pushbutton Switch <https://www.sparkfun.com/products/97> (COM-00097) KIT package intended for soldering kit's - only one side of pads' copper is exposed. PTH-RIGHT-ANGLE-KIT - Right-angle, through-hole Right Angle Tactile Button <https://www.sparkfun.com/products/10791> - Used on SparkFun BigTime Watch Kit <https://www.sparkfun.com/products/11734> SMD-12MM - 12mm square, surface-mount Tactile Button - SMD (12mm) <https://www.sparkfun.com/products/12993> (COM-12993) Used on SparkFun PicoBoard <https://www.sparkfun.com/products/11888> SMD-4.5MM - 4.5mm Square Trackball Switch Used on SparkFun Blackberry Trackballer Breakout <https://www.sparkfun.com/products/13169> SMD-4.6MMX2.8MM - 4.60mm x 2.80mm, surface mount Used on SparkFun SAMD21 Mini Breakout <https://www.sparkfun.com/products/13664> SMD-5.2MM, SMD-5.2-REDUNDANT - 5.2mm square, surface-mount Mini Pushbutton Switch - SMD <https://www.sparkfun.com/products/8720> (COM-08720) Used on Arduino Pro Mini <https://www.sparkfun.com/products/11114> REDUNDANT package connects both switch circuits together SMD-6.0X3.5MM - 6.0 x 3.5mm, surface mount Momentary Reset Switch SMD <https://www.sparkfun.com/products/8229> (COM-08229) SMD-6.2MM-TALL - 6.2mm square, surface mount Tactile Button - SMD (6mm) <https://www.sparkfun.com/products/12992> Used on SparkFun Digital Sandbox <https://www.sparkfun.com/products/12651> SMD-RIGHT-ANGLE - Right-angle, surface mount Used on SparkFun Block for Intel® Edison - Arduino <https://www.sparkfun.com/products/13036>; PROD_ID: SWCH-13065
S3 = 100AWDP1T2B4M2QE:100AWDP1T2B4M2QE: Switch Toggle Dpdt 5a 120v Check availability <https://pricing.snapeda.com/parts/100AWDP1T2B4M2QE/E-Switch/view-part?ref=eda>; AVAILABILITY: In Stock; DESCRIPTION: Toggle Switch DPDT Through Hole; MF: E-Switch; MP: 100AWDP1T2B4M2QE; PACKAGE: None; PRICE: None; PURCHASE-URL: https://pricing.snapeda.com/search/part/100AWDP1T2B4M2QE/?ref=eda
U1 = SparkFun-IC-Conversion:MAX31855K: Cold-Junction-Compensated K-Thermocoupleto-Digital Converter (-270°C to +1800°C) The MAX31855K performs cold-junction compensation and digitizes the signal from a type-K thermocouple. The data is output in a 14-bit resolution, SPI™-compatible, read-only format. This converter resolves temperatures to 0.25°C, allows readings as high as +1800°C and as low as -270°C, and exhibits thermocouple accuracy of ±2°C for temperatures ranging from -200°C to +700°C for K-type thermocouples. Datasheet <https://cdn.sparkfun.com/datasheets/Sensors/Temp/MAX31855K.pdf> SparkFun Products SparkFun Thermocouple Breakout - MAX31855K <https://www.sparkfun.com/products/13266> (SEN-13266); PROD_ID: IC-12578
U2 = ADP5091ACPZ-1-R7:ADP5091ACPZ-1-R7; BUILT_BY: EMA_Colton; COPYRIGHT: Copyright (C) 2018 Accelerated Designs. All rights reserved; DATASHEET: analog.com/media/en/technical-documentation/data-sheets/ADP5091-5092.pdf; MANUFACTURER_PART_NUMBER: ADP5091ACPZ-1-R7; SOURCELIBRARY: Analog_Devices_2020-01-09; VENDOR: Analog Devices Inc
U3 U5 = SparkFun-IC-Microcontroller:ATMEGA32U4: Atmel MCU, 32KByte Atmel 44-pin 8-bit Microcontroller with 32KBytes of ISP Flash and USB Controller Datasheet <http://cdn.sparkfun.com/datasheets/Dev/Arduino/Boards/ATMega32U4.pdf> SparkFun Products LilyPad Arduino USB - ATmega32U4 Board <https://www.sparkfun.com/products/12049> (DEV-12049) Pro Micro - 5V/16MHz <https://www.sparkfun.com/products/12640> (DEV-12640) Pro Micro - 3.3V/8MHz <https://www.sparkfun.com/products/12587> (DEV-12587) Fio v3 - ATmega32U4 <https://www.sparkfun.com/products/11520> (DEV-11520) Qduino Mini <https://www.sparkfun.com/products/13614> (DEV-13614) Makey Makey - Standard Kit <https://www.sparkfun.com/products/11511> (WIG-11511) Makey Makey Deluxe Kit <https://www.sparkfun.com/products/11519> (WIG-11519); PROD_ID: IC-10828
U4 U6 = SparkFun-IC-Power:V_REG_AP2112: AP2112 - 600mA CMOS LDO Regulator w/ Enable The AP2112 is CMOS process low dropout linear regulator with enable function, the regulator delivers a guaranteed 600mA (min.) continuous load current. Features Output Voltage Accuracy: ±1.5% Output Current: 600mA (Min.) Foldback Short Current Protection: 50mA Enable Function to Turn ON/OFF VOUT Low Dropout Voltage (3.3V): 250mV (Typ.) @IOUT=600mA Excellent Load Regulation: 0.2%/A (Typ.) Excellent Line Regulation: 0.02%/V (Typ.) Low Quiescent Current: 55μA (Typ.) Low Standby Current: 0.01μA (Typ.) Low Output Noise: 50μVRMS PSRR: 100Hz -65dB, 1kHz -65dB OTSD Protection Stable with 1.0μF Flexible Cap: Ceramic, Tantalum and Aluminum Electrolytic Operation Temperature Range: -40°C to 85°C ESD: MM 400V, HBM 4000V; PROD_ID: VREG-12457
U7 = RN42-I_RM:RN42-I/RM: Bluetooth 2.1 class 2 surface mount module with built in antenna Check availability <https://pricing.snapeda.com/parts/RN42-I/RM/Microchip/view-part?ref=eda>; AVAILABILITY: In Stock; DESCRIPTION: Bluetooth Bluetooth v2.1 +EDR, Class 2 Transceiver Module 2.4GHz Integrated, Trace Surface Mount; MF: Microchip; MP: RN42-I/RM; PACKAGE: SMD-35 Microchip; PRICE: None; PURCHASE-URL: https://pricing.snapeda.com/search/part/RN42-I/RM/?ref=eda
Y1 Y2 = SparkFun-Clocks:CRYSTAL-16MHZ: 16MHz Crystal Digikey Example <http://www.digikey.com/product-search/en?keywords=535-9122-1-ND> Frequency: 16MHz Frequency Stability: ±50ppm Frequency Tolerance: ±20ppm Load Capacitance: 18pF SparkFun Products: Pro Micro -5V/16MHz <https://www.sparkfun.com/products/12640> SparkFun Serial Enabled LCD Kit <https://www.sparkfun.com/products/10097>; PROD_ID: XTAL-14681

## Module SPARKFUNPRO
Ports: 

### Library data of the parts